# EAGLE design V80_Roco_69380_PLUX22_J2_028_01_04 (EAGLE 5.10)
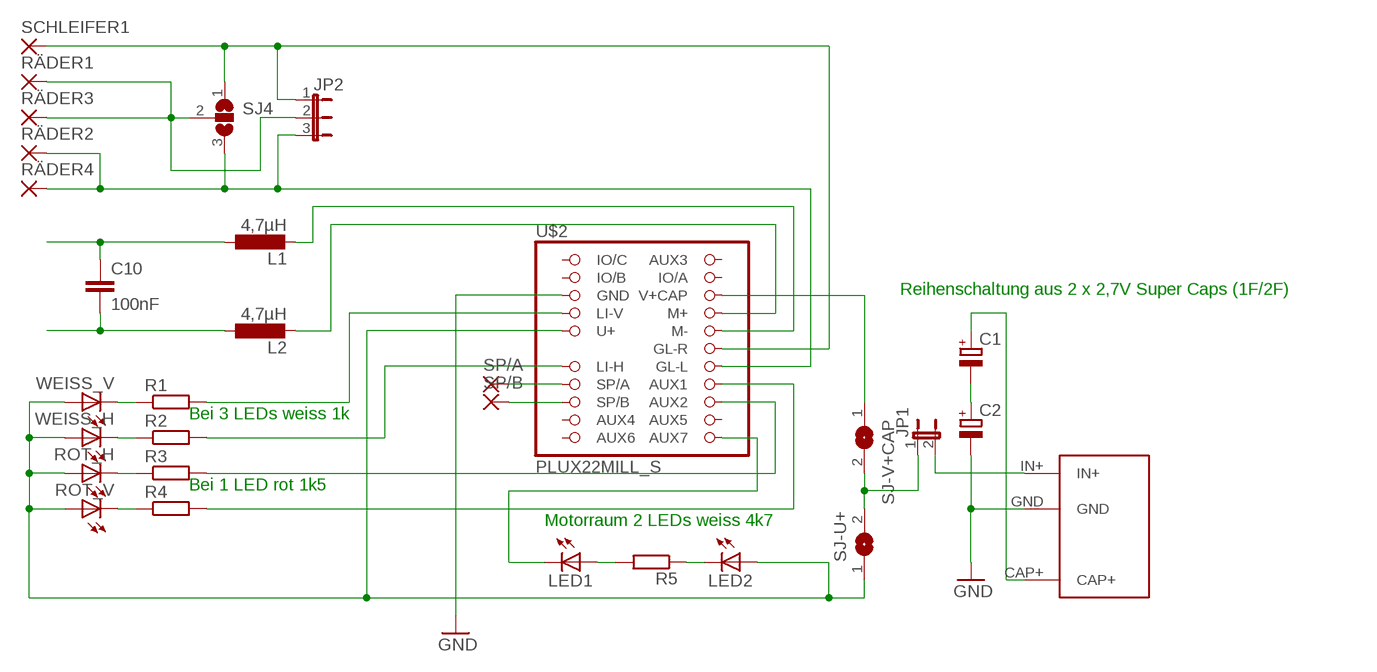
[diagram p0: schematic, sheet 1]

## Parts
C1  CPOL-EU10X6.5L  [10X6.5L]
C2  CPOL-EU10X6.5L  [10X6.5L]
C10  100nF  C-EUC0603  [C0603]
JP1  JP1E2,00R  [JP1_2R]
JP2  JP2E2R  [JP2_2R]
L1  4,7µH  L-EUL1212W  [L1212W]
L2  4,7µH  L-EUL1212W  [L1212W]
LED1  LEDCHIPLED_0603  [CHIPLED_0603]
LED2  LEDCHIPLED_0603  [CHIPLED_0603]
R1  R-EU_R0603  [R0603]
R2  R-EU_R0603  [R0603]
R3  R-EU_R0603  [R0603]
R4  R-EU_R0603  [R0603]
R5  R-EU_R0603  [R0603]
ROT_H  LG_T679-F1G2-1  [PLCC2]
ROT_V  LG_T679-F1G2-1  [PLCC2]
RÄDER1  SMD2  [SMD1,27-2,54]
RÄDER2  SMD2  [SMD1,27-2,54]
RÄDER3  SMD2  [SMD1,27-2,54]
RÄDER4  SMD2  [SMD1,27-2,54]
SCHLEIFER1  SMD2  [SMD1,27-2,54]
SJ4  SJ2W  [SJ_2]
SJ-U+  SJ-  [SJ]
SJ-V+CAP  SJ-  [SJ]
SP/A  SMD2  [SMD1,27-2,54]
SP/B  SMD2  [SMD1,27-2,54]
U$2  PLUX22MILL_S  [PLUX22_SMD_MILL_SOUND]
U$3  PWR_CAPT  [POWER_CAP]
WEISS_H  LG_T679-F1G2-1  [PLCC2]
WEISS_V  LG_T679-F1G2-1  [PLCC2]

## Nets
AUX1: R4.2 U$2.P16(AUX1)
AUX2: R3.2 U$2.P18(AUX2)
BLAU: C10.1 L1.1
CAP+: C1.+ U$3.CAP+
GELB: R2.2 U$2.P13(LI-H)
GND: C2.- U$2.P5(GND) U$3.GND
GRAU: R1.2 U$2.P7(LI-V)
GRÜN: C10.2 L2.1
IN+: JP1.2 U$3.IN+
N$1: R1.1 WEISS_V.C
N$2: R2.1 WEISS_H.C
N$3: R3.1 ROT_H.C
N$4: R4.1 ROT_V.C
N$6: SP/A.1(P) U$2.P15(SP/A)
N$7: SP/B.1(P) U$2.P17(SP/B)
N$8: LED1.C U$2.P22(AUX7)
N$9: LED2.C R5.1
N$11: JP1.1 SJ-U+.2 SJ-V+CAP.2
N$12: LED1.A R5.2
N$13: C1.- C2.+
N$22: L2.2 U$2.P8(M+)
N$23: L1.2 U$2.P10(M-)
RÄDER: JP2.3 RÄDER2.1(P) RÄDER4.1(P) SJ4.3 U$2.P14(GL-L)
RÄDER2: JP2.2 RÄDER1.1(P) RÄDER3.1(P) SJ4.2
SCHLEIFER: JP2.1 SCHLEIFER1.1(P) SJ4.1 U$2.P12(GL-R)
U+: LED2.A ROT_H.A ROT_V.A SJ-U+.1 U$2.P9(U+) WEISS_H.A WEISS_V.A
V+CAP: SJ-V+CAP.1 U$2.P6(V+CAP)
Unconnected: U$2.P1(IO/C) U$2.P2(AUX3) U$2.P3(IO/B) U$2.P4(IO/A) U$2.P19(AUX4) U$2.P20(AUX5) U$2.P21(AUX6)

## Notes on the sheet
- Reihenschaltung aus 2 x 2,7V Super Caps (1F/2F)
- Bei 3 LEDs weiss 1k
- Bei 1 LED rot 1k5
- Motorraum 2 LEDs weiss 4k7

## Library data of the parts
C1 C2 = rcl:CPOL-EU: POLARIZED CAPACITOR, European symbol
C10 = rcl:C-EU: CAPACITOR, European symbol
JP1 = jumper:JP1E: JUMPER
JP2 = jumper:JP2E: JUMPER
L1 L2 = rcl:L-EU: INDUCTOR, European symbol
LED1 LED2 = led:LED: LED OSRAM: - CHIPLED LG R971, LG N971, LY N971, LG Q971, LY Q971, LO R971, LY R971 LH N974, LH R974 LS Q976, LO Q976, LY Q976 LO Q996 - Hyper CHIPLED LW Q18S LB Q993, LB Q99A, LB R99A - SideLED LS A670, LO A670, LY A670, LG A670, LP A670 LB A673, LV A673, LT A673, LW A673 LH A674 LY A675 LS A676, LA A676, LO A676, LY A676, LW A676 LS A679, LY A679, LG A679 - Hyper Micro SIDELED® LS Y876, LA Y876, LO Y876, LY Y876 LT Y87S - SmartLED LW L88C, LW L88S LB L89C, LB L89S, LG L890 LS L89K, LO L89K, LY L89K LS L896, LA L896, LO L896, LY L896 - TOPLED LS T670, LO T670, LY T670, LG T670, LP T670 LSG T670, LSP T670, LSY T670, LOP T670, LYG T670 LG T671, LOG T671, LSG T671 LB T673, LV T673, LT T673, LW T673 LH T674 LS T676, LA T676, LO T676, LY T676, LB T676, LH T676, LSB T676, LW T676 LB T67C, LV T67C, LT T67C, LS T67K, LO T67K, LY T67K, LW E67C LS E67B, LA E67B, LO E67B, LY E67B, LB E67C, LV E67C, LT E67C LW T67C LS T679, LY T679, LG T679 LS T770, LO T770, LY T770, LG T770, LP T770 LB T773, LV T773, LT T773, LW T773 LH T774 LS E675, LA E675, LY E675, LS T675 LS T776, LA T776, LO T776, LY T776, LB T776 LHGB T686 LT T68C, LB T68C - Hyper Mini TOPLED® LB M676 - Mini TOPLED Santana® LG M470 LS M47K, LO M47K, LY M47K Source: http://www.osram.convergy.de LUXEON: - LUMILED® LXK2-PW12-R00, LXK2-PW12-S00, LXK2-PW14-U00, LXK2-PW14-V00 LXK2-PM12-R00, LXK2-PM12-S00, LXK2-PM14-U00 LXK2-PE12-Q00, LXK2-PE12-R00, LXK2-PE12-S00, LXK2-PE14-T00, LXK2-PE14-U00 LXK2-PB12-K00, LXK2-PB12-L00, LXK2-PB12-M00, LXK2-PB14-N00, LXK2-PB14-P00, LXK2-PB14-Q00 LXK2-PR12-L00, LXK2-PR12-M00, LXK2-PR14-Q00, LXK2-PR14-R00 LXK2-PD12-Q00, LXK2-PD12-R00, LXK2-PD12-S00 LXK2-PH12-R00, LXK2-PH12-S00 LXK2-PL12-P00, LXK2-PL12-Q00, LXK2-PL12-R00 Source: www.luxeon.com KINGBRIGHT: KA-3528ASYC Source: www.kingbright.com
R1-R5 = rcl:R-EU_: RESISTOR, European symbol
ROT_H ROT_V WEISS_H WEISS_V = led:*_T679-?-1: LC TOPLED® Low Current LED Source: http://catalog.osram-os.com .. LG_LS_LY_T679_OBS.pdf; COLOR: green
RÄDER1-RÄDER4 SCHLEIFER1 SP/A SP/B = wirepad:SMD2: SMD PAD
SJ4 = jumper:SJ2W: SMD solder JUMPER
SJ-U+ SJ-V+CAP = jumper:SJ: SMD solder JUMPER
U$2 = pinhead:PLUX22
U$3 = pinhead:PWR_CAP

## Board
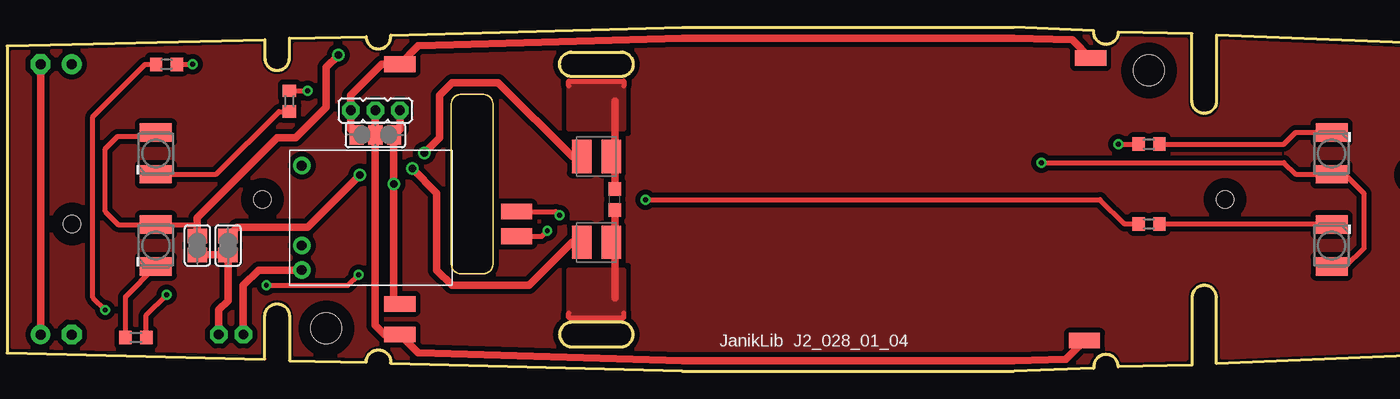
[diagram p1: board, top side]
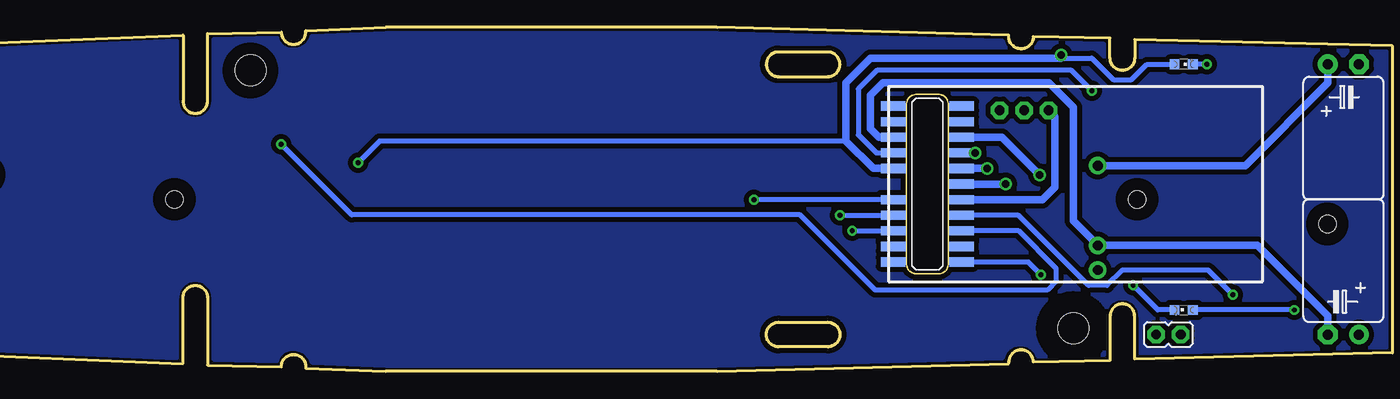
[diagram p2: board, bottom side, seen from below]

No outline drawn. Coordinates in mm, seen from the top.
Copper layers (1*16): Top 0.035mm / dielectric 1.5mm / Bottom 0.035mm
Design rules "default *": minimum track width 10mil, minimum drill 0.4mm, track to track 8mil, track to pad 8mil, pad to pad 8mil, via to via 8mil, smd to smd 8mil, copper to edge 40mil, drill to drill 8mil, minimum pad ring 10mil, minimum via ring 8mil, stop-mask expansion 4mil, vias tented up to drill 0mil, thermal gap 10mil
Holes 2.5 mm at 93,23 26,2
Holes 1.4 mm at 114.7,14.5 99.2,12.5 5.3,10.5 20.8,12.5
bKeepout: area 41.5,2.5 to 77.5,22.5
tRestrict: area 45,22.5 to 51,24.5; area 45,0.5 to 51,2.5; area 45,0.5 to 51,2.5
bRestrict: area 26,-1 to 28.5,1.5; area 23.5,-0.5 to 28.5,4.5; area 45,22.5 to 51,24.5; area 45,0.5 to 51,2.5
Milling: 56 lines

### Footprints (pad centres in the part's own frame; a part is rotated, then mirrored left to right if it is on the bottom)
10X6.5L = drill 0.813 pad 1.6 round: + 1.27,0 | drill 0.813 pad 1.6 octagon: - -1.27,0
C0603 = smd 1.1 x 1: 1 -0.85,0; 2 0.85,0
JP1_2R = drill 0.8 pad 1.422 octagon: 1 0,-1; 2 0,1
JP2_2R = drill 0.8 pad 1.422 octagon: 1 0,-2; 2 0,0; 3 0,2
L1212W = smd 1.6 x 2.7: 1 -1.2,0; 2 1.2,0
CHIPLED_0603 = smd 0.8 x 0.8: A 0,-0.75; C 0,0.75
R0603 = smd 1 x 1.1: 1 -0.85,0; 2 0.85,0
PLCC2 = smd 2.6 x 1.5: A 0,1.7; C 0,-1.7
SMD1,27-2,54 = smd 1.27 x 2.54: 1 0,0
SJ_2 = smd 1.168 x 1.6: 1 -1.524,0; 2 0,0; 3 1.524,0
SJ = smd 1.168 x 1.6: 1 -0.762,0; 2 0.762,0
PLUX22_SMD_MILL_SOUND = smd 0.75 x 2: P1 -6.35,-2.792; P2 -6.35,2.792; P3 -5.08,-2.792; P4 -5.08,2.792; P5 -3.81,-2.792; P6 -3.81,2.792; P7 -2.54,-2.792; P8 -2.54,2.792; P9 -1.27,-2.792; P10 -1.27,2.792; P12 0,2.792; P13 1.27,-2.792; P14 1.27,2.792; P15 2.54,-2.792; P16 2.54,2.792; P17 3.81,-2.792; P18 3.81,2.792; P19 5.08,-2.792; P20 5.08,2.792; P21 6.35,-2.792; P22 6.35,2.792
POWER_CAP = drill 0.8 pad 1.422 round: CAP+ 0,-6.5; GND 0,0; IN+ 0,2

### Placement (x,y rotation side)
C1  4,23.5 180 bottom
C2  4,1.5 0 bottom
C10  49.5,12.5 90 top
JP1  18.25,1.5 90 bottom
JP2  30,19.75 90 top
L1  48,9 180 top
L2  48,16 180 top
LED1  17,3.5 90 bottom
LED2  17,23.5 270 bottom
R1  23,20.5 90 top
R2  93,10.5 180 top
R3  93,17 180 top
R4  10.5,1.25 0 top
R5  13,23.5 180 top
ROT_H  107.88,16.25 180 top
ROT_V  12.12,8.75 0 top
RÄDER1  32,1.5 90 top
RÄDER2  32,23.5 90 top
RÄDER3  87.75,1 90 top
RÄDER4  88.25,24 90 top
SCHLEIFER1  32,4 90 top
SJ4  30,17.75 180 top
SJ-U+  15.5,8.75 270 top
SJ-V+CAP  18,8.75 270 top
SP/A  41.5,11.5 270 top
SP/B  41.5,9.5 270 top
U$2  37.88,13.75 270 bottom
U$3  24,8.75 180 top
WEISS_H  107.88,8.75 180 top
WEISS_V  12.12,16.25 0 top

### Tracks (layer width: path | path; a pad name or v marks a point on that pad's centre or on a via)
AUX1  (via drill 0.4)
  Top 0.406: R4.2 11.35,3.1 v13,4.75
  Bottom 0.406: U$2.P16 30.46,11.21 24.75,5.5 23.25,5.5 22,6.75 15,6.75 v13,4.75
AUX2  (via drill 0.4)
  Top 0.406: v90.5,17 R3.2
  Bottom 0.406: v90.5,17 84.75,11.25 48.25,11.25 42.12,5.12 28.12,5.12 27.38,5.88 27.38,6.88 30.44,9.94 U$2.P18
BLAU
  Top 0.406: 45.75,3.25 45.75,2.88 50.25,2.88 50.25,3.25
  Top 0.61: 49.5,9 C10.1 | 49.5,9 L1.1 | 49.5,4.5 49.5,9
  pour Top (isolate 0.406): 50.25,6.75 45.75,6.75 45.75,2.75 50.25,2.75
CAP+
  Bottom 0.61: U$3.CAP+ 12,15.25 5.27,21.98 C1.+
GELB  (via drill 0.4)
  Top 0.406: v52,12.48 89.02,12.48 91,10.5 R2.2
  Bottom 0.406: U$2.P13 v52,12.48
GND
  Bottom 0.61: U$2.P5 41.81,17.56 42.5,18.25 42.5,21 41.5,22 28,22 26,20 26,10.75 U$3.GND 11,8.75 5.27,3.02 C2.-
GRAU  (via drill 0.4)
  Top 0.406: R1.2 v24.5,21.35
  Bottom 0.406: U$2.P7 42.04,16.29 43.5,17.75 43.5,21.5 42,23 26.15,23 v24.5,21.35
GRÜN
  Top 0.406: 50.25,21.75 50.25,22.12 45.75,22.12 45.75,21.75
  Top 0.61: C10.2 49.5,16 | 49.5,20.5 49.5,18.5 49.5,16 | 49.5,16 L2.1
  pour Top (isolate 0.406): 45.75,18.25 50.25,18.25 50.25,22.25 45.75,22.25
IN+
  Top 0.61: JP1.2 19.25,5.5 20.5,6.75 U$3.IN+
N$1
  Top 0.406: 12.18,14.5 WEISS_V.C 17.05,14.55 22.15,19.65 R1.1
N$2
  Top 0.406: WEISS_H.C 107.83,10.5 R2.1
N$3
  Top 0.406: 107.83,18 ROT_H.C 104.95,17.95 104,17 R3.1
N$4
  Top 0.406: ROT_V.C 9.65,4.58 R4.1
N$5
  pour Bottom (isolate 0.406, rank 2): 0.5,0.5 0.5,24.5 20.5,25 20.5,24 arc90 22,22.5 arc90 23.5,24 23.5,25.12 28.75,25.25 arc67 30.25,24.25 30.38,24.25 arc79 31.75,25.38 55,26 82,26 88,25.75 arc74 89.5,24.62 89.62,24.62 arc77 90.88,25.62 96,25.5 96,20.5 arc90 97.5,19 arc90 99,20.5 99,25.38 119.5,24.5 119.5,0.5 99,-0.38 99,4.5 arc90 97.5,6 arc90 96,4.5 96,-0.5 90.88,-0.62 arc77 89.62,0.38 89.5,0.38 arc74 88,-0.75 82,-1 55,-1 31.75,-0.38 arc79 30.38,0.75 30.25,0.75 arc72 28.88,-0.25 23.5,-0.12 23.5,3 arc90 22,4.5 arc90 20.5,3 20.5,0
  pour Top (isolate 0.406, rank 2): 0.5,0.5 0.5,24.5 20.5,25 20.5,24 arc90 22,22.5 arc90 23.5,24 23.5,25.12 28.75,25.25 arc67 30.25,24.25 30.38,24.25 arc79 31.75,25.38 55,26 82,26 88,25.75 arc74 89.5,24.62 89.62,24.62 arc77 90.88,25.62 96,25.5 96,20.5 arc90 97.5,19 arc90 99,20.5 99,25.38 119.5,24.5 119.5,0.5 99,-0.38 99,4.5 arc90 97.5,6 arc90 96,4.5 96,-0.5 90.88,-0.62 arc77 89.62,0.38 89.5,0.38 arc74 88,-0.75 82,-1 55,-1 31.75,-0.38 arc79 30.38,0.75 30.25,0.75 arc72 28.88,-0.25 23.5,-0.12 23.5,3 arc90 22,4.5 arc90 20.5,3 20.5,0
N$6  (via drill 0.4)
  Top 0.406: SP/A.1 44.71,11.5 v45,11.21
  Bottom 0.406: v45,11.21 U$2.P15
N$7  (via drill 0.4)
  Top 0.406: SP/B.1 43.56,9.5 v44,9.94
  Bottom 0.406: v44,9.94 U$2.P17
N$8  (via drill 0.4)
  Top 0.406: v21.12,5.5 27.75,5.5 v28.62,6.38
  Bottom 0.406: LED1.C 19.12,3.5 v21.12,5.5 | U$2.P22 29.65,7.4 v28.62,6.38
N$9  (via drill 0.4)
  Top 0.406: R5.1 v15.12,23.5
  Bottom 0.406: v15.12,23.5 LED2.C
N$11
  Top 0.61: SJ-U+.2 SJ-V+CAP.2 18,4.25 17.25,3.5 JP1.1
N$12  (via drill 0.4)
  Top 0.406: v8,3.5 7,4.5 7,19.25 11.25,23.5 R5.2
  Bottom 0.406: v8,3.5 LED1.A
N$13
  Top 0.61: C2.+ C1.-
N$22  (via drill 0.6)
  Top 0.61: L2.2 46,16 40,22 36.25,22 35.25,21 35.25,17.54 v34,16.29
  Bottom 0.61: U$2.P8 v34,16.29
N$23  (via drill 0.6)
  Top 0.61: L1.2 46,9 42.5,5.5 36.25,5.5 35,6.75 35,13.02 v33,15.02
  Bottom 0.61: v33,15.02 U$2.P10
RÄDER
  Top 0.61: RÄDER4.1 86.75,25.5 82,25.62 55,25.62 33.5,25 RÄDER2.1 30.5,23.5 28,21 JP2.3 28,18.23 SJ4.3
  Bottom 0.61: U$2.P14 28.52,12.48 27.5,13.5 27.5,19.25 JP2.3
RÄDER2
  Top 0.61: RÄDER3.1 86.25,-0.5 82,-0.62 55,-0.62 33.5,0 RÄDER1.1 30.75,1.5 30,2.25 SJ4.2 JP2.2
SCHLEIFER  (via drill 0.6)
  Top 0.61: JP2.1 32,18.23 SJ4.1 31.5,17.73 v31.5,13.75 31.5,4.5 SCHLEIFER1.1
  Bottom 0.61: v31.5,13.75 U$2.P12
U+  (via drill 0.4, 0.6)
  Top 0.406: WEISS_H.A 109.05,7.05 110.5,8.5 110.5,13 108.95,14.55 ROT_H.A 104.95,14.55 104,15.5 v84.25,15.5 | 15.5,10.45 ROT_V.A 9.05,10.45 8,11.5 8,16.62 9,17.62 11.8,17.62 WEISS_V.A
  Top 0.61: SJ-U+.1 15.5,10.45 15.5,11 22,17.5 23.5,17.5 26,20 26,23.25 v27,24.25
  Bottom 0.406: 44.5,17.25 82.5,17.25 v84.25,15.5 | LED2.A 20,23.5 21.25,22.25 22.75,22.25 24.5,24 27,24
  Bottom 0.61: U$2.P9 42.27,15.02 44.5,17.25 44.5,22 42.5,24 27,24 v27,24.25
V+CAP  (via drill 0.6)
  Top 0.61: SJ-V+CAP.1 18.74,10.25 24.5,10.25 v28.75,14.5
  Bottom 0.61: U$2.P6 31.81,17.56 v28.75,14.5

### Text on the board
tNames: JanikLib J2_028_01_04
tStop: Rad1 | Rad1 | Roco 69380/69381 | V80 PLUX22 Sound | design by Janik Merz | AC | DC | R | W | SP | R | W | U+ | Schleifer | CAP | Rad2 | Rad2
bStop: CAP+ | PLUX22 | GND
Measures: F | F | F | F